# EasyEDA schematic ArduinoPowerLogger.json
TITLE: New Schematic; REV: 1.0; Date: 2018-06-24; Sheet: 1/1; Drawn By: pal.mark28
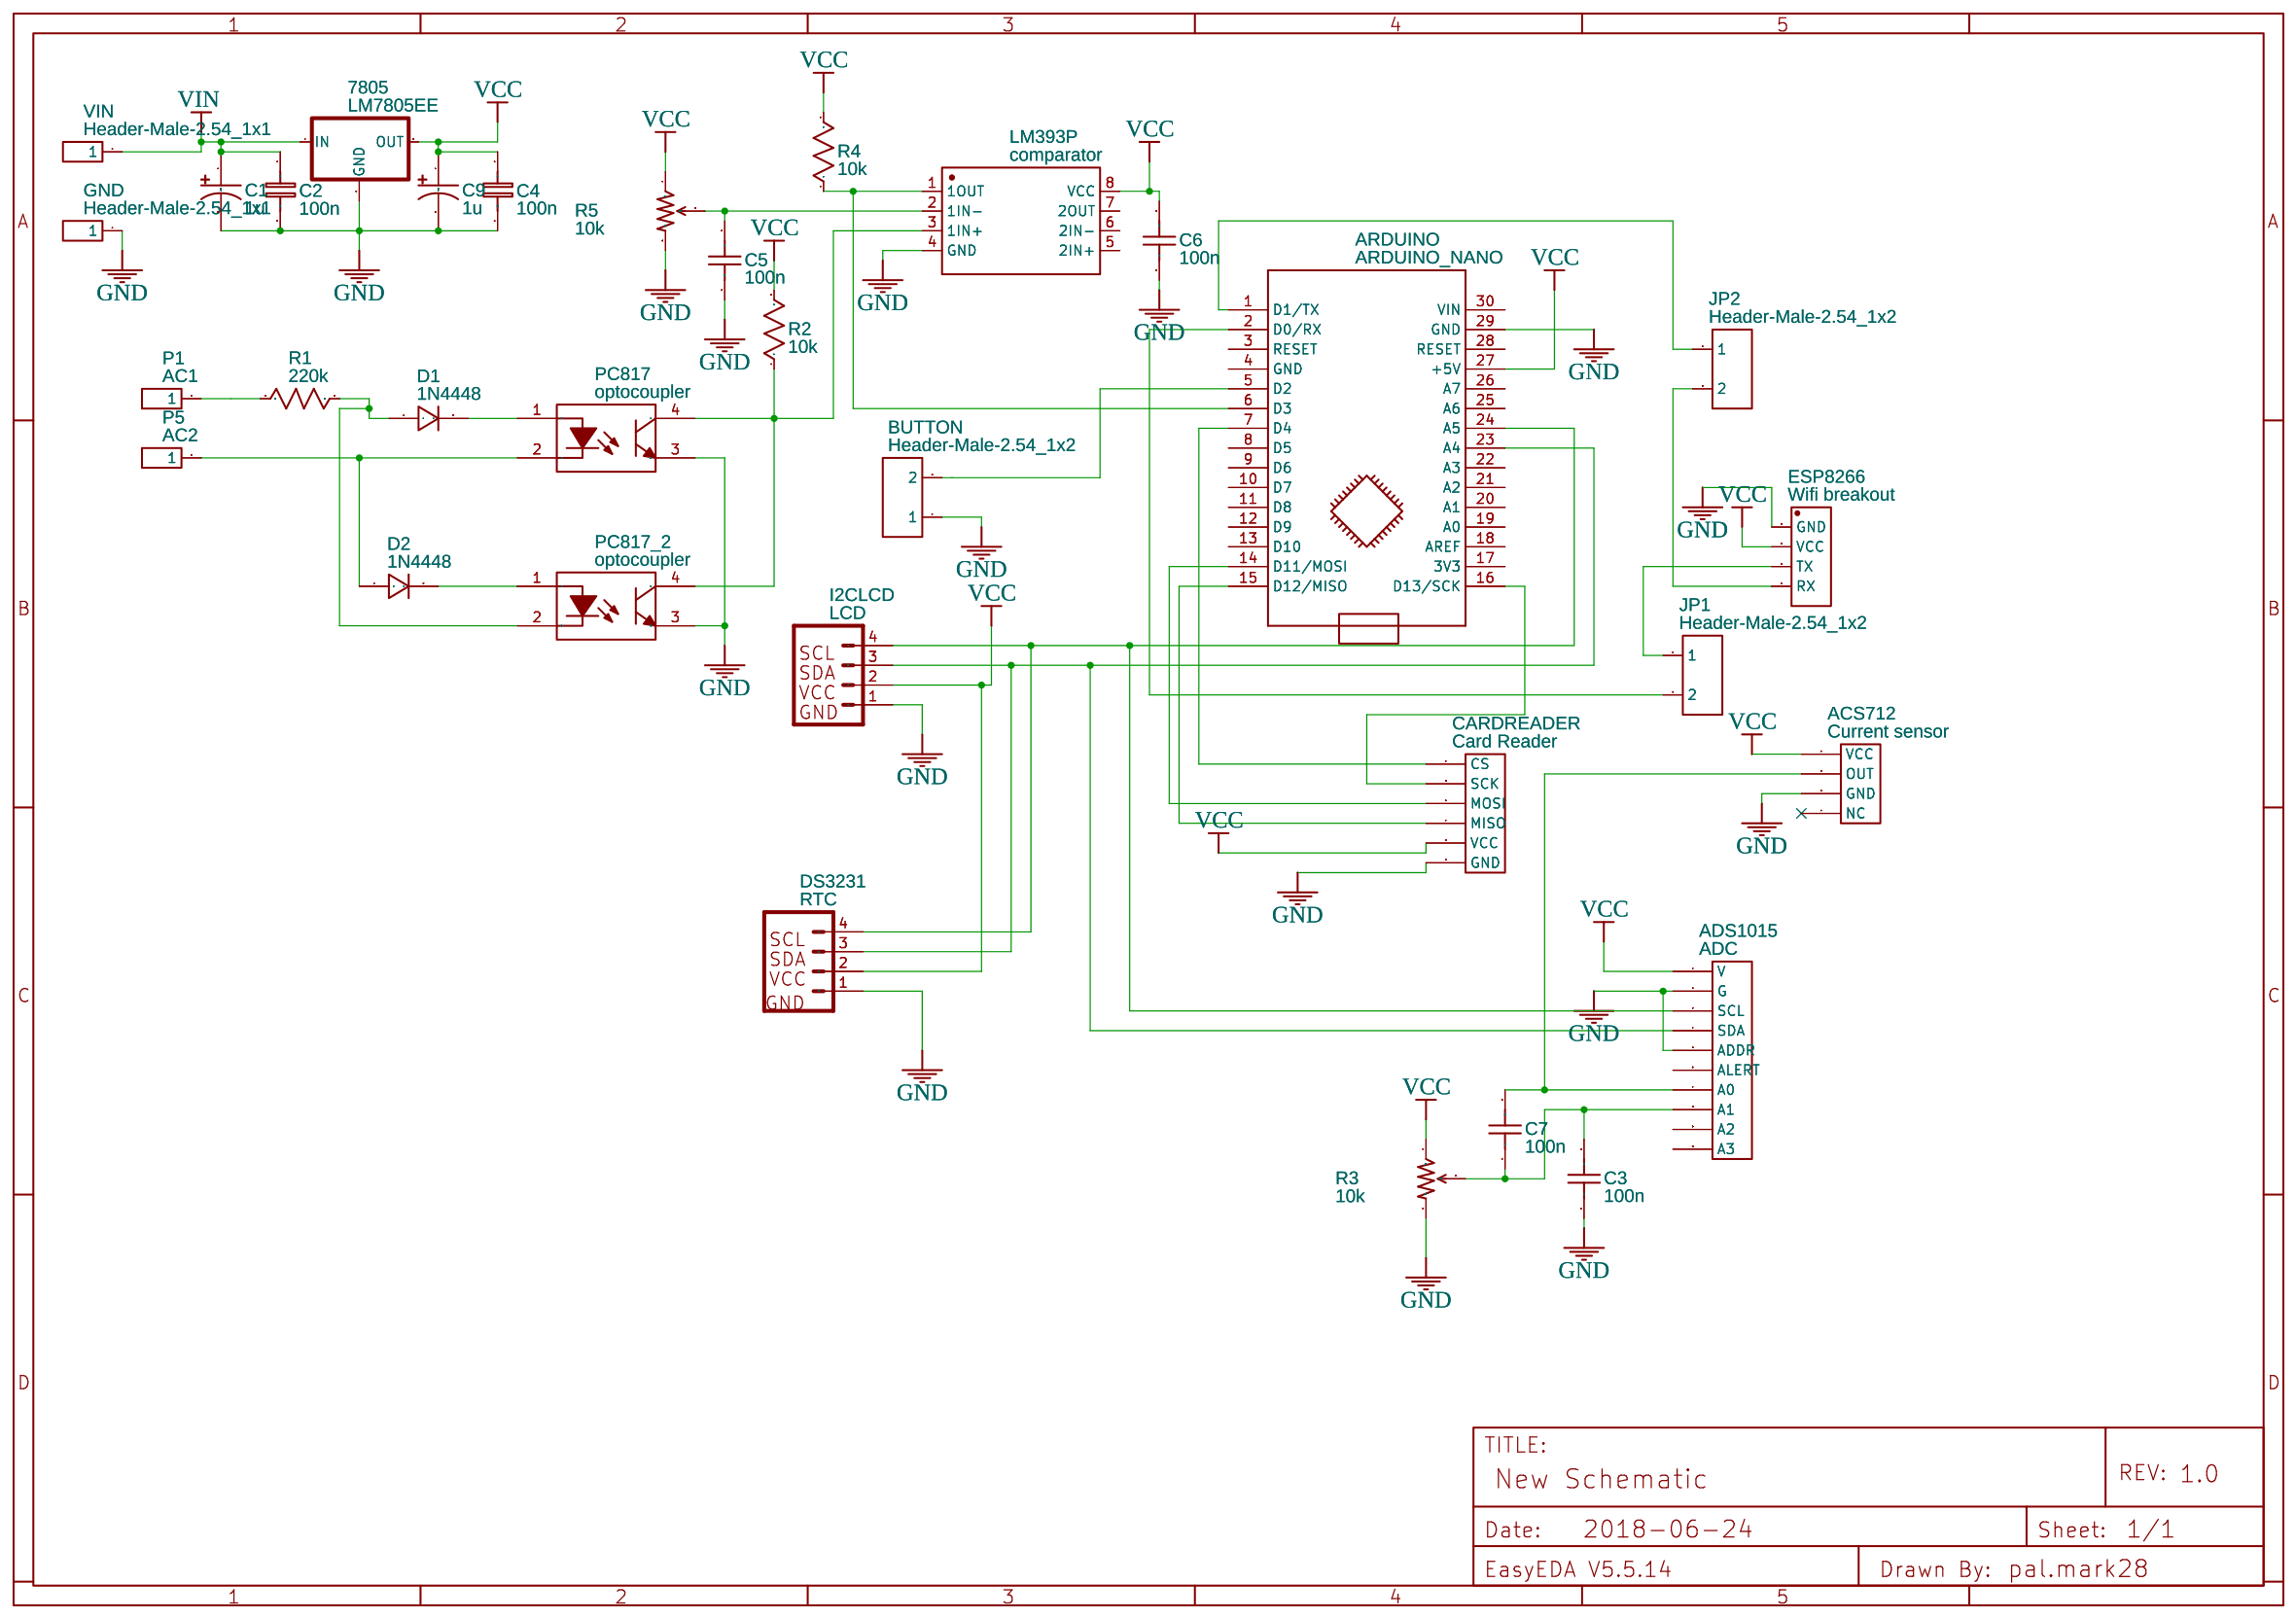
[diagram p0: schematic sheet]

## Parts
7805  LM7805EE  [TO-220]
ACS712  Current sensor  [HDR-4X1/2.54]
ADS1015  ADC  [HDR-10X1/2.54]
ARDUINO  ARDUINO_NANO  [ARDUINO_NANO]
BUTTON  Header-Male-2.54_1x2  [HDR-2X1/2.54]
C1  1u  [CAP-D6.3XF2.5]
C2  100n  [RAD-0.1]
C3  100n  [RAD-0.1]
C4  100n  [RAD-0.1]
C5  100n  [RAD-0.1]
C6  100n  [RAD-0.1]
C7  100n  [RAD-0.1]
C9  1u  [CAP-D6.3XF2.5]
CARDREADER  Card Reader  [HDR-6X1/2.54]
D1  1N4448  [DO-35]
D2  1N4448  [DO-35]
DS3231  RTC  [1X04]
ESP8266  Wifi breakout  [DIP-1X4P-2.54MM-M]
GND  Header-Male-2.54_1x1  [HDR-1X1/2.54]
I2CLCD  LCD  [1X04]
JP1  Header-Male-2.54_1x2  [HDR-2X1/2.54]
JP2  Header-Male-2.54_1x2  [HDR-2X1/2.54]
LM393P  comparator  [DIP-8]
P1  AC1  [HDR-1X1/2.54]
P5  AC2  [HDR-1X1/2.54]
PC817  optocoupler  [DIP-4]
PC817_2  optocoupler  [DIP-4]
R1  220k  [AXIAL-0.3]
R2  10k  [AXIAL-0.3]
R3  10k  [3362U-2]
R4  10k  [AXIAL-0.3]
R5  10k  [3362U-2]
VIN  Header-Male-2.54_1x1  [HDR-1X1/2.54]

## Library data of the parts
7805 = 78XX: Manufacturer Part: ?
ACS712 = -: Supplier: LCSC; Manufacturer: ReliaPro; Manufacturer Part: Female header pitch2.54mm
ADS1015 = -: Supplier: LCSC; Manufacturer: BOOMELE; Manufacturer Part: 2.54mm 1*10P Straight Female header Gold-plated; LCSC: C35445
ARDUINO = -: sourceId: KGSeAWhDB; Manufacturer Part: ?
BUTTON JP1 JP2 = -: Supplier: LCSC; Manufacturer: TE Connectivity; Manufacturer Part: 826629-2; LCSC: C86471; image: //image.lceda.cn/szlcsc/C86471.jpg
C1 C9 = Cap_Electrolytic(TH)_D6.3XF2.5_US: Manufacturer Part: ?
C2 C4 = Cap_RAD-0.1_EU: Manufacturer Part: ?
C3 C5-C7 = Cap_RAD-0.1_US: Manufacturer Part: ?
CARDREADER = -: Supplier: LCSC; Manufacturer: BOOMELE; Manufacturer Part: Female header 1*6p; LCSC: C40877
D1 D2 = -: Supplier: LCSC; Manufacturer: SEMTECH; LCSC: C54037; image: //image.lceda.cn/szlcsc/C54037.jpg
DS3231 I2CLCD = -: SparkFun has standardized on a pinout for all I2C based sensor breakouts.; Contributor: SparkFun; Manufacturer Part: ?
ESP8266 = -: Supplier: LCSC; Manufacturer: Ckmtw; Manufacturer Part: 210S-1*4P L=11.6MMGold-plated black; LCSC: C124378; Contributor: LCSC
GND VIN = -: Supplier: LCSC; Manufacturer: ReliaPro; LCSC: C81276
LM393P = -: Supplier: LCSC; Manufacturer: TI; LCSC: C5209; image: //image.lceda.cn/szlcsc/C5209.jpg
P1 P5 = -: Supplier: LCSC; Manufacturer: ReliaPro; Manufacturer Part: Header-Male-2.54_1x1; LCSC: C81276
PC817 PC817_2 = -: Supplier: LCSC; Manufacturer: SHARP; Manufacturer Part: PC817X2NSZ9F(B); LCSC: C60965; image: //image.lceda.cn/szlcsc/C60965.jpg
R1 R2 R4 = Res_AXIAL-0.3(1/8W)_US: Manufacturer Part: ?
R3 R5 = -: Contributor: SparkFun; Manufacturer Part: ?

## Nets
GND: 7805.2(GND) ACS712.3(GND) ADS1015.2(G) ADS1015.5(ADDR) ARDUINO.29(GND) BUTTON.1 C1.2 C2.2 C3.1 C4.2 C5.1 C6.1 C9.2 CARDREADER.6(GND) DS3231.1 ESP8266.1(GND) GND.1 I2CLCD.1 LM393P.4(GND) PC817.3 PC817_2.3 R3.3(CW) R5.3(CW)
VCC: 7805.3(OUT) ACS712.1(VCC) ADS1015.1(V) ARDUINO.27(+5V) C4.1 C6.2 C9.1 CARDREADER.5(VCC) DS3231.2 ESP8266.2(VCC) I2CLCD.2 LM393P.8(VCC) R2.2 R3.1(CCW) R4.2 R5.1(CCW)
VIN: 7805.1(IN) C1.1 C2.1 VIN.1
Net-(ACS712-2): ACS712.2(OUT) ADS1015.7(A0) C7.2
Net-(ADS1015-3): ADS1015.3(SCL) ARDUINO.24(A5) DS3231.4 I2CLCD.4
Net-(ADS1015-4): ADS1015.4(SDA) ARDUINO.23(A4) DS3231.3 I2CLCD.3
Net-(ADS1015-8): ADS1015.8(A1) C3.2 C7.1 R3.2(WIPER)
Net-(ARDUINO-1): ARDUINO.1(D1/TX) JP2.1
Net-(ARDUINO-2): ARDUINO.2(D0/RX) JP1.2
Net-(ARDUINO-5): ARDUINO.5(D2) BUTTON.2
Net-(ARDUINO-6): ARDUINO.6(D3) LM393P.1(1OUT) R4.1
Net-(ARDUINO-7): ARDUINO.7(D4) CARDREADER.1(CS)
Net-(ARDUINO-14): ARDUINO.14(D11/MOSI) CARDREADER.3(MOSI)
Net-(ARDUINO-15): ARDUINO.15(D12/MISO) CARDREADER.4(MISO)
Net-(ARDUINO-16): ARDUINO.16(D13/SCK) CARDREADER.2(SCK)
Net-(C5-2): C5.2 LM393P.2(1IN-) R5.2(WIPER)
Net-(D1-1): D1.1(A) PC817_2.2 R1.2
Net-(D1-2): D1.2(K) PC817.1
Net-(D2-1): D2.1(A) P5.1 PC817.2
Net-(D2-2): D2.2(K) PC817_2.1
Net-(ESP8266-3): ESP8266.3(TX) JP1.1
Net-(ESP8266-4): ESP8266.4(RX) JP2.2
Net-(LM393P-3): LM393P.3(1IN+) PC817.4 PC817_2.4 R2.1
Net-(P1-1): P1.1 R1.1

Not connected (* = marked no-connect by the designer): ACS712 4(NC)*; ADS1015 6(ALERT) 9(A2) 10(A3); ARDUINO 3(RESET) 4(GND) 8(D5) 9(D6) 10(D7) 11(D8) 12(D9) 13(D10) 17(3V3) 18(AREF) 19(A0) 20(A1) 21(A2) 22(A3) 25(A6) 26(A7) 28(RESET) 30(VIN); LM393P 5(2IN+) 6(2IN-) 7(2OUT)
